# Altium project wch554e.PrjPcb
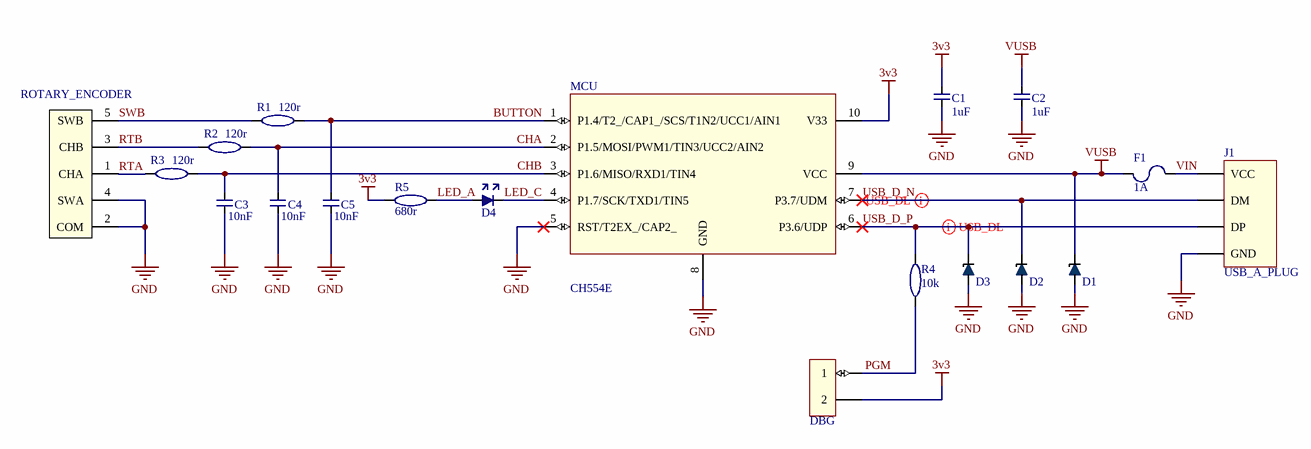
[diagram p0: wch554e.SchDoc]
1 sheet, 19 parts. Net scope: global (net labels, ports and power ports of the same name join across sheets).
Board file: wch554e.PcbDoc

## Sheet wch554e.SchDoc: Tiny Volume Knob
size 290 x 209 mm; Author: skilbeck.com; Revision: 1; SheetNumber: 1; SheetTotal: 1

### Parts
C1  1uF  [MLCC_0603]
C2  1uF  [MLCC_0603]
C3  10nF  [MLCC_0603]
C4  10nF  [MLCC_0603]
C5  10nF  [MLCC_0603]
D1  TVS_DIODE  [TVS_DIODE]  (value not drawn)
D2  TVS_DIODE  [TVS_DIODE]  (value not drawn)
D3  TVS_DIODE  [TVS_DIODE]  (value not drawn)
D4  (no value)  [SMT_LED_0603]
DBG  CON4  [CON4]  (value not drawn)
F1  1A  [FUSE_0805]
J1  USB_A_PLUG  [USB_A]
MCU  CH554E  [MSOP10]
R1  120r  [SMT_RES_0603]
R2  120r  [SMT_RES_0603]
R3  120r  [SMT_RES_0603]
R4  10k  [SMT_RES_0603]
R5  680r  [SMT_RES_0603]
ROTARY_ENCODER  ROTARY_ENCODER  [ENCODER]  (value not drawn)  (no BOM)

### Nets
3v3: C1.2(B) DBG.2 MCU.10(V33) R5.1(A)
GND: C1.1(A) C2.1(A) C3.1(A) C4.1(A) C5.1(A) D1.2(A) D2.2(A) D3.2(A) J1.4(GND) MCU.5(RST/T2EX_/CAP2_) MCU.8(GND) ROTARY_ENCODER.2(COM) ROTARY_ENCODER.4(SWA)
VUSB: C2.2(B) D1.1(K) F1.2 MCU.9(VCC)
BUTTON: C5.2(B) MCU.1(P1.4/T2_/CAP1_/SCS/T1N2/UCC1/AIN1) R1.2(B)
CHA: C4.2(B) MCU.2(P1.5/MOSI/PWM1/TIN3/UCC2/AIN2) R2.2(B)
CHB: C3.2(B) MCU.3(P1.6/MISO/RXD1/TIN4) R3.2(B)
LED_A: D4.1(CATHODE) R5.2(B)
LED_C: D4.2(ANODE) MCU.4(P1.7/SCK/TXD1/TIN5)
PGM: DBG.1 R4.1(A)
RTA: R3.1(A) ROTARY_ENCODER.1(CHA)
RTB: R2.1(A) ROTARY_ENCODER.3(CHB)
SWB: R1.1(A) ROTARY_ENCODER.5(SWB)
USB_D_N: D2.1(K) J1.2(DM) MCU.7(P3.7/UDM)
USB_D_P: D3.1(K) J1.3(DP) MCU.6(P3.6/UDP) R4.2(B)
VIN: F1.1 J1.1(VCC)

### Layout directives
differential pair: USB_D_N, USB_D_P

### Library data of the parts
C1-C5 = CAP_CERAMIC: MLCC
  C1 C2: Value: 1uF; Supplier Part No. 1: C105524
  C3-C5: Value: 10nF; Supplier Part No. 1: C519509
D1-D3 = TVS_DIODE: TVS Diode; Supplier Part No. 1: C384848
D4 = LED: Supplier Part No. 1: C434424
DBG = CON4: Debug header
F1 = FUSE: Value: 1A; Supplier Part No. 1: C70061
R1-R5 = RESISTOR
  R1-R3: Value: 120r; Supplier Part No. 1: C22787
  R4: Value: 10k; Supplier Part No. 1: C25804
  R5: Value: 680r; Supplier Part No. 1: C23228
ROTARY_ENCODER = ROTARY_ENCODER: Rotary Encoder
MCU = CH554E: Supplier Part No. 1: C111293